# Altium schematic sheet Thermometer.SchDoc: Thermometer
size A4; ApprovedBy: Martin Papai; CheckedBy: Martin Papai; Author: Martin Papai; DrawnBy: Martin Papai; Engineer: Martin Papai; DocumentNumber: 1; Revision: A; SheetNumber: 1; SheetTotal: 1
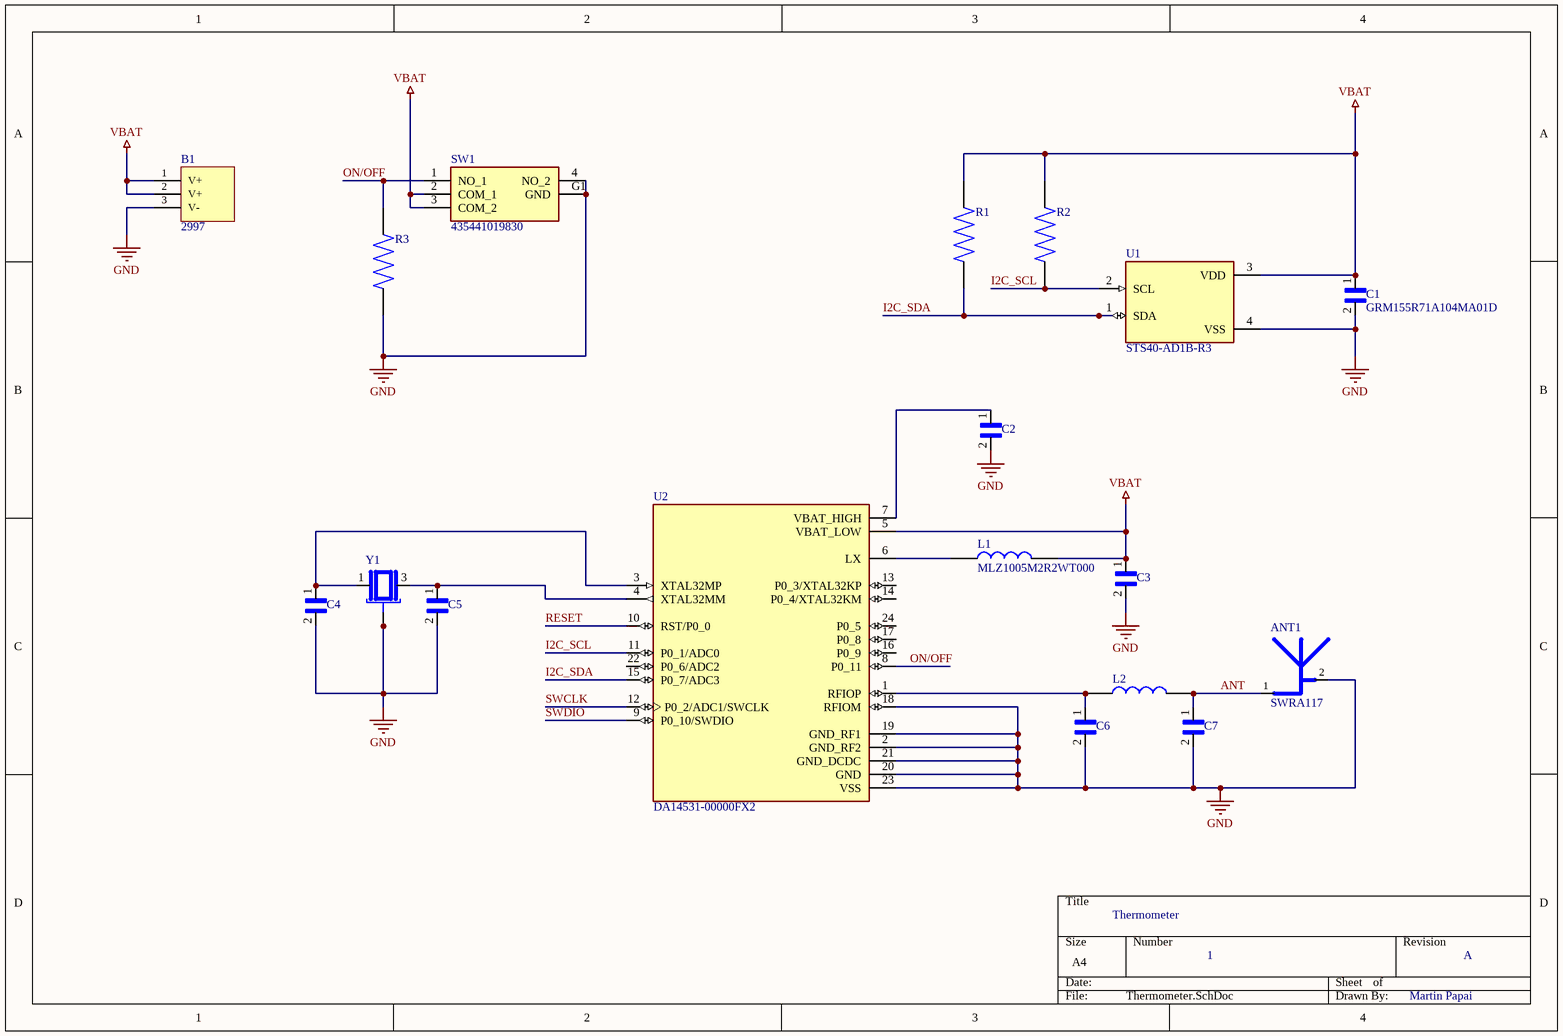
[diagram p0: Thermometer.SchDoc]

## Parts
ANT1  SWRA117  [SWRA117]
B1  2997  [2997]
C1  GRM155R71A104MA01D  [CAPC1005X60]
C2  C0402C105K8PAC7411  [CAPC1005X60]  (value not drawn)
C3  GRM155R60J106ME05J  [CAPC1005X60]  (value not drawn)
C4  GCM1555C1H8R0DA16D  [CAPC1005X60]  (value not drawn)
C5  GCM1555C1H8R0DA16D  [CAPC1005X60]  (value not drawn)
C6  GRM1555C2A1R8CA01D  [CAPC1005X60]  (value not drawn)
C7  GRM1555C2A1R8CA01D  [CAPC1005X60]  (value not drawn)
L1  MLZ1005M2R2WT000  [INDC1005X55N]
L2  LQG15HN3N3S02D  [LQG15WH0N7B02D]  (value not drawn)
R1  RC0402FR-7W10KL  [RES1005]  (value not drawn)
R2  RC0402FR-7W10KL  [RES1005]  (value not drawn)
R3  RC0402FR-7W10KL  [RES1005]  (value not drawn)
SW1  435441019830  [435441019830]
U1  STS40-AD1B-R3  [STS4X]
U2  DA14531-00000FX2  [XCVR_DA14531-00000FX2]
Y1  ECS-320-6-37B2-CKM-TR  [XTAL_ECS-320-6-37B2-CKM-TR]  (value not drawn)

## Nets
GND: ANT1.2(Ret) B1.3(V-) C1.2 C2.2 C3.2 C4.2 C5.2 C6.2 C7.2 R3.1 SW1.4(NO_2) SW1.G1(GND) U1.4(VSS) U2.2(GND_RF2) U2.18(RFIOM) U2.19(GND_RF1) U2.20(GND) U2.21(GND_DCDC) U2.23(VSS) Y1.2(GND) Y1.4(GND)
VBAT: B1.1(V+) B1.2(V+) C1.1 C3.1 L1.2 R1.2 R2.2 SW1.2(COM_1) SW1.3(COM_2) U1.3(VDD) U2.5(VBAT_LOW)
ANT: ANT1.1(FP) C7.1 L2.2
I2C_SCL: R2.1 U1.2(SCL) U2.11(P0_1/ADC0)
I2C_SDA: R1.1 U1.1(SDA) U2.15(P0_7/ADC3)
ON/OFF: R3.2 SW1.1(NO_1) U2.8(P0_11)
RESET: U2.10(RST/P0_0)
SWCLK: U2.12(P0_2/ADC1/SWCLK)
SWDIO: U2.9(P0_10/SWDIO)
NetC2_1: C2.1 U2.7(VBAT_HIGH)
NetC4_1: C4.1 U2.3(XTAL32MP) Y1.1
NetC5_1: C5.1 U2.4(XTAL32MM) Y1.3
NetC6_1: C6.1 L2.1 U2.1(RFIOP)
NetL1_1: L1.1 U2.6(LX)

Not connected (* = marked no-connect by the designer): U2 13(P0_3/XTAL32KP) 14(P0_4/XTAL32KM) 16(P0_9) 17(P0_8) 22(P0_6/ADC2) 24(P0_5)

## Library data of the parts
ANT1 = SWRA117: TI 2.4Ghz PCB Antenna
B1 = 2997: Coin Cell Battery Holders THM .520x.585x.500 No Hole
C1 = GRM155R71A104MA01D: Multilayer Ceramic Capacitors MLCC - SMD/SMT 0.1 uF 10 VDC 20% 0402 X7R; Value: 0.1uF
C2 = C0402C105K8PAC7411: Multilayer Ceramic Capacitors MLCC - SMD/SMT 10V 1uF X5R 0402 10%
C3 = GRM155R60J106ME05J: Multilayer Ceramic Capacitors MLCC - SMD/SMT 10 uF 6.3 VDC 20% 0402 X5R; Value: 10uF
C4 C5 = GCM1555C1H8R0DA16D: Multilayer Ceramic Capacitors MLCC - SMD/SMT 8 pF 50 VDC 0.5 pF 0402 C0G (NP0) AEC-Q200; Value: 8pF
C6 C7 = GRM1555C2A1R8CA01D: Multilayer Ceramic Capacitors MLCC - SMD/SMT 1.8 pF 100 VDC 0.25 pF 0402 C0G (NP0); Value: 1.8pF
L1 = MLZ1005M2R2WT000: Inductor Power Shielded Multi-Layer 2.2uH 20% 2MHz Ferrite 350mA 715mOhm DCR 0402 T/R; Manufacturer_Name: TDK; Geometry.Height: 0.55mm; Mouser Part Number: 810-MLZ1005M2R2WT000; Mouser Price/Stock: https://www.mouser.co.uk/ProductDetail/TDK/MLZ1005M2R2WT000?qs=%2FPzWLGNeQ%252BiWY3SLL2a3ow%3D%3D; Manufacturer_Part_Number: MLZ1005M2R2WT000; Datasheet Link: https://product.tdk.com/system/files/dam/doc/product/inductor/inductor/smd/catalog/inductor_commercial_decoupling_mlz1005_en.pdf
L2 = LQG15HN3N3S02D: Murata LQQ15HN Series Wire-wound SMD Inductor 0.0033 uH +/-0.3nH 300mA Idc Q:8; Manufacturer_Name: Murata Electronics; Geometry.Height: 0.55mm; Mouser Part Number: 81-LQG15HN3N3S02D; Mouser Price/Stock: https://www.mouser.co.uk/ProductDetail/Murata-Electronics/LQG15HN3N3S02D?qs=wJtOAfHdpWANFtzVLk4I7Q%3D%3D; Manufacturer_Part_Number: LQG15HN3N3S02D; Datasheet Link: https://psearch.en.murata.com/inductor/product/LQG15HN3N3S02%23.html
R1-R3 = RC0402FR-7W10KL: Thick Film Resistors - SMD 10 kOhms 125mW 0402 1%; Value: 10k; MP: CRCW060310K0FKEBC; Package: None; Price: None; Availability: Unavailable
SW1 = 435441019830: Tactile Switches WS-TASV Tact Switch Washable 4.1x2.8x1.9 mm SMT; Manufacturer_Name: Wurth Elektronik; Geometry.Height: 1.9mm; Mouser Part Number: 710-435441019830; Mouser Price/Stock: https://www.mouser.co.uk/ProductDetail/Wurth-Elektronik/435441019830?qs=ufv2HEpFn%252BQgnhl%2FsZ0Vfw%3D%3D; Manufacturer_Part_Number: 435441019830; Datasheet Link: https://www.we-online.com/catalog/datasheet/435441019830.pdf
U1 = STS40-AD1B-R3: Digital Temperature Sensor, Â±0.2 Â°C, Ultra-Low-Power, I2C fast mode plus; MF: Sensirion; SnapEDA_Link: https://www.snapeda.com/parts/STS40-AD1B-R3/Sensirion/view-part/?ref=snap; Price: None; Check_prices: https://www.snapeda.com/parts/STS40-AD1B-R3/Sensirion/view-part/?ref=eda; Purchase-URL: https://pricing.snapeda.com/search/part/STS40-AD1B-R3/?ref=eda; Package: DFN-4 Sensirion; MP: STS40-AD1B-R3; Value: *; Availability: In Stock
U2 = DA14531-00000FX2: IC RF TxRx + MCU Bluetooth Bluetooth v5.1 2.4GHz FCGQFN 24; MF: Dialog Semiconductor GmbH; MP: DA14531-00000FX2; Value: *; SnapEDA_Link: https://www.snapeda.com/parts/DA14531-00000FX2/Dialog+Semiconductor/view-part/?ref=snap; Package: FCGQFN-24 Dialog Semiconductor GmbH; Check_prices: https://www.snapeda.com/parts/DA14531-00000FX2/Dialog+Semiconductor/view-part/?ref=eda
Y1 = ECS-320-6-37B2-CKM-TR: Crystals ESR 50,FREQ 32,STABILITY +/-10ppm,TOLERANCE +/-10ppm,CL 6pF,AGING +/-2 ppm ,-20 C 70 C,10uW in typical (Max 100uW),2.00mm x 1.60mm; MF: ECS Inc.; Purchase-URL: https://pricing.snapeda.com/search/part/ECS-320-6-37B2-CKM-TR/?ref=eda; Check_prices: https://www.snapeda.com/parts/ECS-320-6-37B2-CKM-TR/ECS+Inc./view-part/?ref=eda; SnapEDA_Link: https://www.snapeda.com/parts/ECS-320-6-37B2-CKM-TR/ECS+Inc./view-part/?ref=snap; Availability: In Stock; Price: None; MP: ECS-320-6-37B2-CKM-TR; Package: None; Value: *